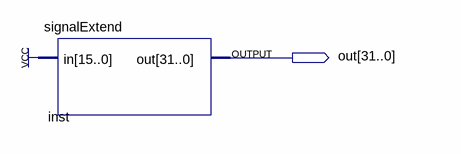
[diagram p0: schematic sheet]
// Quartus schematic teste.bdf as structural Verilog: 1 symbols, 1 pins
module teste (
  output [31:0] out
);

  signalExtend inst (.in({16{1'b1}}), .out(out));
endmodule
